# Altium schematic sheet PowerModule.SchDoc: CAN Current Loop Module - Power
size A4; Author: Pablo R Nava; DrawnBy: Pablo R Nava; Engineer: Pablo R Nava
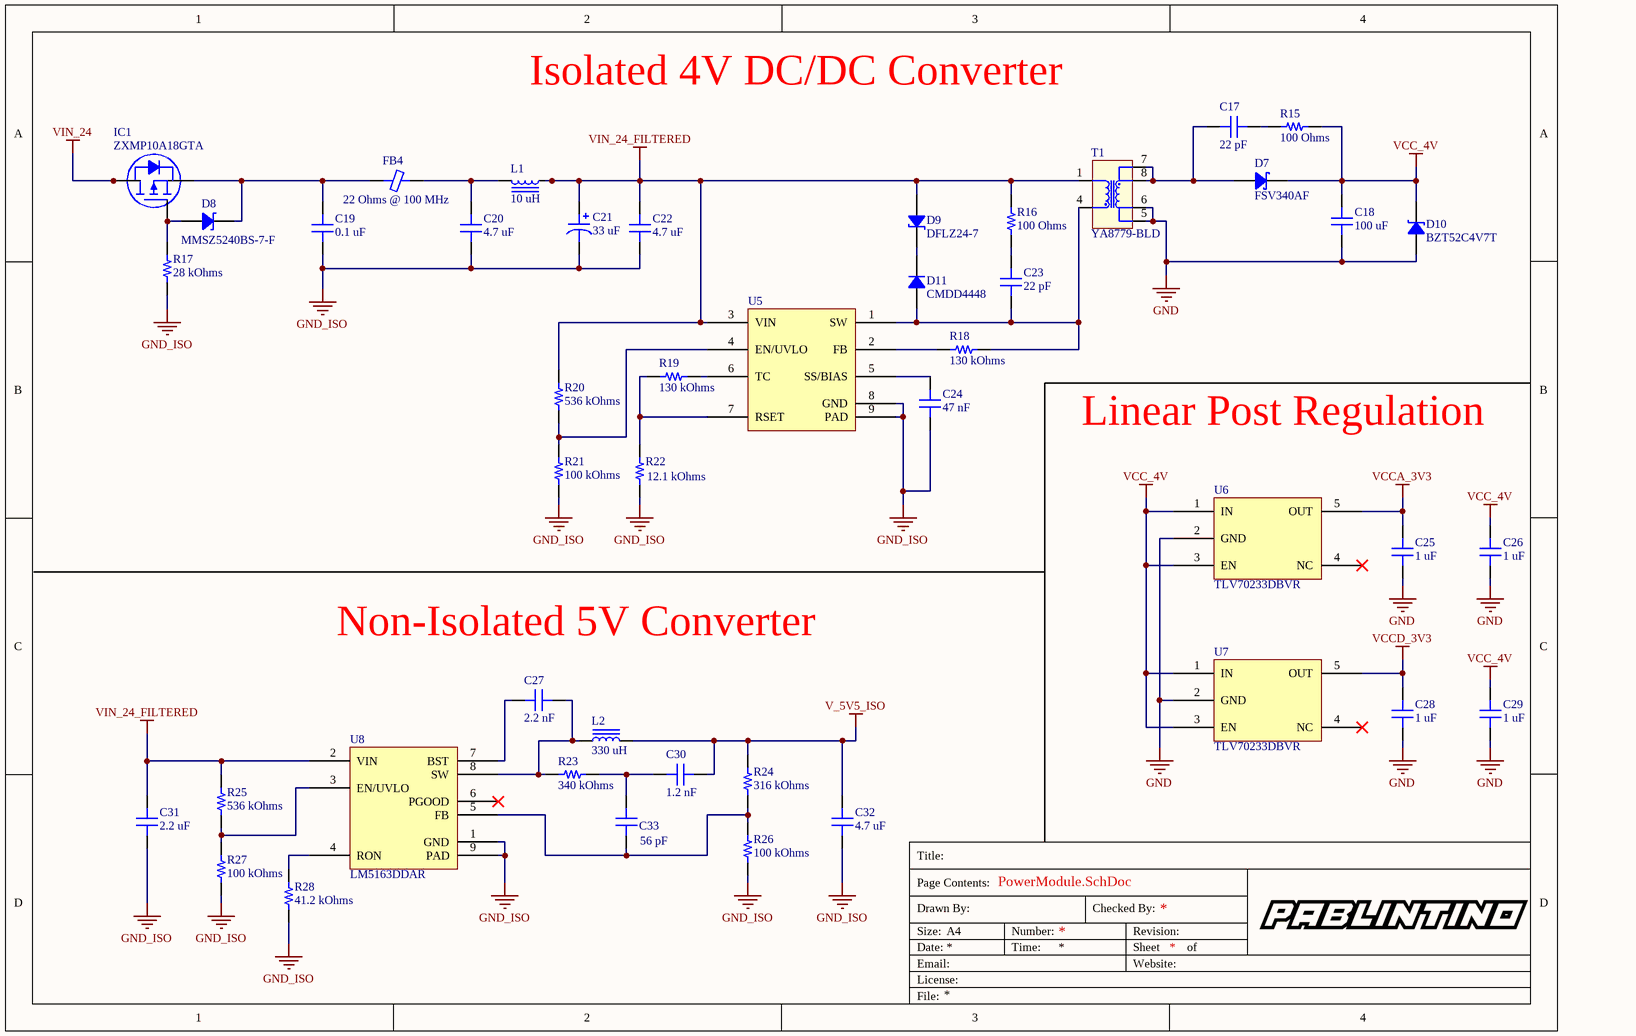
[diagram p0: PowerModule.SchDoc]

## Parts
C17  22 pF  [CAP 0805_2012]
C18  100 uF  [CAP 1210_3225 - 2.5MM]
C19  0.1 uF  [CAP 0805_2012]
C20  4.7 uF  [CAP 1210_3225 - 2.0MM]
C21  33 uF  [CAP ALSMD POLY 10.3MM H10.2MM]
C22  4.7 uF  [CAP 1210_3225 - 2.0MM]
C23  22 pF  [CAP 0805_2012]
C24  47 nF  [CAP 0805_2012]
C25  1 uF  [CAP 0805_2012]
C26  1 uF  [CAP 0805_2012]
C27  2.2 nF  [CAP 0805_2012]
C28  1 uF  [CAP 0805_2012]
C29  1 uF  [CAP 0805_2012]
C30  1.2 nF  [CAP 0805_2012]
C31  2.2 uF  [CAP 1210_3225 - 2.5MM]
C32  4.7 uF  [CAP 1210_3225 - 2.0MM]
C33  56 pF  [CAP 0805_2012]
D7  FSV340AF  [ON DO214AD SMAF]
D8  MMSZ5240BS-7-F  [SOD-123]
D9  DFLZ24-7  [POWERDI123]
D10  BZT52C4V7T  [SOD-523]
D11  CMDD4448  [SOD323]
FB4  22 Ohms @ 100 MHz  [FER 0805_2012]
IC1  ZXMP10A18GTA  [DIODES SOT-223]
L1  10 uH  [WE-TPC_4818]
L2  330 uH  [BOURNS SRR1280]
R15  100 Ohms  [RES 0805_2012]
R16  100 Ohms  [RES 0805_2012]
R17  28 kOhms  [RES 0805_2012]
R18  130 kOhms  [RES 0805_2012]
R19  130 kOhms  [RES 0805_2012]
R20  536 kOhms  [RES 0805_2012]
R21  100 kOhms  [RES 0805_2012]
R22  12.1 kOhms  [RES 0805_2012]
R23  340 kOhms  [RES 0805_2012]
R24  316 kOhms  [RES 0805_2012]
R25  536 kOhms  [RES 0805_2012]
R26  100 kOhms  [RES 0805_2012]
R27  100 kOhms  [RES 0805_2012]
R28  41.2 kOhms  [RES 0805_2012]
T1  YA8779-BLD  [YA8779]
U5  LM5180QNGURQ1  [TI WSON-8 NGU]  (value not drawn)
U6  TLV70233DBVR  [TI SOT-23-5 DBV]
U7  TLV70233DBVR  [TI SOT-23-5 DBV]
U8  LM5163DDAR  [SOIC_DDAR_TEX]

## Nets
GND: C18.2 C25.2 C26.2 C28.2 C29.2 D10.1 T1.5 T1.6 U6.2(GND) U7.2(GND)
GND_ISO: C19.2 C20.1 C21.2 C22.1 C24.1 C31.1 C32.1 R17.1 R21.1 R22.2 R26.2 R27.1 R28.2 U5.8(GND) U5.9(PAD) U8.1(GND) U8.9(PAD)
V_5V5_ISO: C30.1 C32.2 L2.2 R24.1
VCC_4V: C18.1 C26.1 C29.1 D7.2 D10.2 R15.1 U6.1(IN) U6.3(EN) U7.1(IN) U7.3(EN)
VCCA_3V3: C25.1 U6.5(OUT)
VCCD_3V3: C28.1 U7.5(OUT)
VIN_24: IC1.2(D) IC1.4(D)
VIN_24_FILTERED: C21.1 C22.2 C31.2 D9.1 L1.1 R16.2 R20.1 R25.1 T1.1 U5.3(VIN) U8.2(VIN)
NetC17_1: C17.1 D7.1 T1.7 T1.8
NetC17_2: C17.2 R15.2
NetC19_1: C19.1 D8.2 FB4.2 IC1.3(S)
NetC20_2: C20.2 FB4.1 L1.2
NetC23_1: C23.1 R16.1
NetC23_2: C23.2 D11.1 R18.1 T1.4 U5.1(SW)
NetC24_2: C24.2 U5.5(SS/BIAS)
NetC27_1: C27.1 L2.1 R23.2 U8.8(SW)
NetC27_2: C27.2 U8.7(BST)
NetC30_2: C30.2 C33.2 R23.1
NetC33_1: C33.1 R24.2 R26.1 U8.5(FB)
NetD8_1: D8.1 IC1.1(G) R17.2
NetD9_2: D9.2 D11.2
NetR18_2: R18.2 U5.2(FB)
NetR19_1: R19.1 U5.6(TC)
NetR19_2: R19.2 R22.1 U5.7(RSET)
NetR20_2: R20.2 R21.2 U5.4(EN/UVLO)
NetR25_2: R25.2 R27.2 U8.3(EN/UVLO)
NetR28_1: R28.1 U8.4(RON)

Not connected (* = marked no-connect by the designer): U6 4(NC)*; U7 4(NC)*; U8 6(PGOOD)*

## Notes on the sheet
- Isolated 4V DC/DC Converter
- Linear Post Regulation
- Non-Isolated 5V Converter
- Title:
- Drawn By:
- Page Contents:
- Checked By:
- Size:
- Date:
- File:
- License:
- Email:
- A4
- Number:
- Time:
- Revision:
- Sheet
- Website:
- of

## Library data of the parts
C17 C23 = 08051C220JAT2A: MLCC Ceramic 22 pF 100 V 5% Capacitor; Manufacturer: AVX; Voltage: 100 V; Type: capacitor_ceramic; Through Hole: 0; Part Number: 08051C220JAT2A; Value: 22 pF; Tolerance: 5%; Composition: X7R; Created On: 03/07/2020 16:35:00; Updated On: 03/07/2020 16:36:02; Package: 0805 (2012 Metric)
C18 = JMK325AC7107MM-P: MLCC Ceramic 100 uF 6.3 V 20% Capacitor; Manufacturer: Taiyo Yuden; Voltage: 6.3 V; Type: capacitor_ceramic; Through Hole: 0; Part Number: JMK325AC7107MM-P; Value: 100 uF; Tolerance: 20%; Composition: X7S; Created On: 03/07/2020 19:44:15; Updated On: 03/07/2020 19:44:30; Package: 1210 (3225 Metric)
C19 = 08051C104J4T4A: MLCC Ceramic 0.1 uF 100 V 10% Capacitor; Manufacturer: AVX; Voltage: 100 V; Type: capacitor_ceramic; Through Hole: 0; Part Number: 08051C104J4T4A; Value: 0.1 uF; Tolerance: 10%; Composition: X7R; Created On: 10/07/2020 23:21:56; Updated On: 10/07/2020 23:22:31; Package: 0805 (2012 Metric)
C20 C22 C32 = C3225X7S2A475M200AB: MLCC Ceramic 4.7 uF 100 V 20% Capacitor; Manufacturer: TDK; Voltage: 100 V; Type: capacitor_ceramic; Through Hole: 0; Part Number: C3225X7S2A475M200AB; Value: 4.7 uF; Tolerance: 20%; Composition: X7S; Created On: 10/07/2020 20:19:29; Updated On: 10/07/2020 20:19:45; Package: 1210 (3225 Metric)
C21 = EEEFK2A330P: Aluminum Electrolytic 33 uF 100 V 20% Capacitor; Manufacturer: Panasonic; Voltage: 100 V; Material: aluminium; Polarised: 1; ESR: 700 mOhms; Lifetime Temperature: 2000 Hours @ 105 ºC; Minimum Temperature: 105 ºC; Maximum Temperature: -55 ºC; Type: capacitor_electrolytic; Through Hole: 0; Part Number: EEEFK2A330P; Value: 33 uF; Tolerance: 20%; Created On: 08/07/2020 20:44:47; Updated On: 08/07/2020 21:47:25; Package: SMD
C24 = C2012X7R2A473K125AA: MLCC Ceramic 47 nF 100 V 10% Capacitor; Manufacturer: TDK; Voltage: 200 V; Type: capacitor_ceramic; Through Hole: 0; Part Number: C2012X7R2A473K125AA; Value: 47 nF; Tolerance: 10%; Composition: X7R; Created On: 31/05/2020 9:04:57; Updated On: 31/05/2020 9:07:12; Package: 0805 (2012 Metric)
C25 C26 C28 C29 = 0805YC105KAT4A: MLCC Ceramic 1 uF 16 V 10% Capacitor; Manufacturer: AVX; Voltage: 16 V; Type: capacitor_ceramic; Through Hole: 0; Part Number: 0805YC105KAT4A; Value: 1 uF; Tolerance: 10%; Composition: X7R; Created On: 18/07/2020 20:46:26; Updated On: 18/07/2020 20:46:47; Package: 0805 (2012 Metric)
C27 = C0805C222K5RACTU: MLCC Ceramic 2.2 nF 50 V 10% Capacitor; Manufacturer: KEMET; Voltage: 50 V; Type: capacitor_ceramic; Through Hole: 0; Part Number: C0805C222K5RACTU; Value: 2.2 nF; Tolerance: 10%; Composition: X7R; Created On: 16/07/2020 19:02:56; Updated On: 16/07/2020 19:04:14; Package: 0805 (2012 Metric)
C30 = 08055C122KAT2A: MLCC Ceramic 1.2 nF 50 V 10% Capacitor; Manufacturer: AVX; Voltage: 50 V; Type: capacitor_ceramic; Through Hole: 0; Part Number: 08055C122KAT2A; Value: 1.2 nF; Tolerance: 10%; Composition: X7R; Created On: 16/07/2020 19:09:00; Updated On: 16/07/2020 19:09:07; Package: 0805 (2012 Metric)
C31 = C3225X7R2A225K230AB: MLCC Ceramic 2.2 uF 100 V 10% Capacitor; Manufacturer: TDK; Voltage: 100 V; Type: capacitor_ceramic; Through Hole: 0; Part Number: C3225X7R2A225K230AB; Value: 2.2 uF; Tolerance: 10%; Composition: X7R; Created On: 20/07/2020 23:03:57; Updated On: 20/07/2020 23:04:45; Package: 1210 (3225 Metric)
C33 = 08055A560JAT2A: MLCC Ceramic 56 pF 50 V 5% Capacitor; Manufacturer: AVX; Tolerance: 10%; Voltage: 50 V; Type: capacitor_ceramic; Through Hole: 0; Part Number: 08055A560JAT2A; Value: 56 pF; Composition: NP0; Created On: 16/07/2020 19:36:43; Updated On: 16/07/2020 19:36:54; Package: 0805 (2012 Metric)
D7 = FSV340AF: Schottky Diode; Manufacturer: ON Semiconductor; Forward Voltage: 0.5 V; Reverse Leakage Current: 100 uA; Maximum Forward Avg. Current: 3 A; Maximum Repetitive Reverse Voltage: 40 V; Type: diode_rectifier; Through Hole: 0; Part Number: FSV340AF; Diode Type: schottky; Created On: 30/06/2020 19:58:51; Updated On: 30/06/2020 20:11:25; Package: DO-214AD
D8 = MMSZ5240BS-7-F: Zener 200 mW 10 V; Manufacturer: Diodes Incorporated; Maximum Power: 200 mW; Forward Voltage: 0.9 V; Zener Voltage: 10 V; Type: diode_zener; Through Hole: 0; Part Number: MMSZ5240BS-7-F; Created On: 19/07/2020 12:49:44; Updated On: 19/07/2020 13:00:21; Package: SOD-323-2
D9 = DFLZ24-7: Power Zener 1 W 24 V; Manufacturer: Diodes Incorporated; Maximum Power: 1 W; Forward Voltage: 24 V; Type: diode_zener; Through Hole: 0; Part Number: DFLZ24-7; Created On: 30/06/2020 21:18:03; Updated On: 30/06/2020 21:18:48; Package: PowerDI 123-2
D10 = BZT52C4V7T: Zener 300 mW 4.7 V; Part Number: BZT52C4V7T
D11 = CMDD4448: High Speed Silicon Switching Diode; Manufacturer: Central Semiconductor Corp.; Forward Voltage: 1 V; Reverse Leakage Current: 25 nA; Maximum Forward Avg. Current: 250 mA; Maximum Repetitive Reverse Voltage: 100 V; Diode Type: rectifier; Type: diode_rectifier; Through Hole: 0; Part Number: CMDD4448; Created On: 02/07/2020 19:02:22; Updated On: 02/07/2020 19:05:20; Package: SOD-323
FB4 = 742792021: Ferrite bead 22 Ohms @ 100 MHz; Manufacturer: Würth Electronik; Number of Lines: 1; DC Resistance: 8 mOhms; Current Rating: 6 A; Type: ferrite_bead; Through Hole: 0; Part Number: 742792021; Value: 22 Ohms @ 100 MHz; Impedance Frequency: 22 Ohms @ 100 MHz; Created On: 10/07/2020 22:54:16; Updated On: 10/07/2020 23:17:54; Package: 0805 (2012 Metric)
IC1 = ZXMP10A18GTA: MOSFET 100V P-Chnl UMOS; Manufacturer: Diodes Incorporated; Drain Source Resistance: 150 mOhms; Gate Source Max Voltage: 20 V; Gate Source Threshold Voltage: 2 V; Drain Source Max Current: 3.7 A; Maximum Power: 3.9 W; Channel Type: P-Channel; Through Hole: 0; Part Number: ZXMP10A18GTA; Drain Source Max Voltage: 100 V; Created On: 19/07/2020 8:37:51; Updated On: 19/07/2020 11:20:23; Type: transistor_mosfet; Package: SOT-223-4
L1 = 744042100: Tinny Power Inductor 10 uH 1.3 A; Manufacturer: Würth Electronik; Resistance DCR: 120 mOhms; Test Frequency: 100 kHz; Current Rating: 1.3 A; Current Saturation: 1 A; Tolerance: 30%; Type: power_inductor; Through Hole: 0; Part Number: 744042100; Value: 10 uH; Created On: 10/07/2020 20:04:38; Updated On: 10/07/2020 20:09:18; Package: ACT45B
L2 = SRR1208-331KL: Shielded Power Inductor 330 uH 0.85 A; Manufacturer: Bourns; Resistance DCR: 650 mOhms; Test Frequency: 0.796 MHz; Current Rating: 0.85 A; Current Saturation: 1.12 A; Tolerance: 10%; Type: power_inductor; Through Hole: 0; Part Number: SRR1208-331KL; Value: 330 uH; Created On: 13/07/2020 19:41:55; Updated On: 13/07/2020 19:43:17; Package: SRR1280
R15 R16 = CRCW0805100RFKEAC: Thin Film Resistor 100 Ohms 1%; Manufacturer: Vishay / Dale; Power Max: 125 mW; Through Hole: 0; Part Number: CRCW0805100RFKEAC; Value: 100 Ohms; Tolerance: 1%; Created On: 16/05/2020 11:51:25; Updated On: 16/05/2020 13:13:19; Type: resistor; Package: 0805 (2012 Metric)
R17 = CRCW080528K0FKEA: Thin Film Resistor 28 kOhms 1%; Manufacturer: Vishay / Dale; Power Max: 125 mW; Through Hole: 0; Part Number: CRCW080528K0FKEA; Value: 28 kOhms; Tolerance: 1%; Created On: 19/07/2020 13:06:42; Updated On: 19/07/2020 13:07:02; Type: resistor; Package: 0805 (2012 Metric)
R18 R19 = CRCW0805130KFKEAC: Thin Film Resistor 130 kOhms 1%; Manufacturer: Vishay / Dale; Power Max: 125 mW; Through Hole: 0; Part Number: CRCW0805130KFKEAC; Value: 130 kOhms; Tolerance: 1%; Created On: 09/07/2020 18:08:17; Updated On: 09/07/2020 18:08:28; Type: resistor; Package: 0805 (2012 Metric)
R20 R25 = CRCW0805536KFKEA: Thin Film Resistor 536 kOhms 1%; Manufacturer: Vishay / Dale; Power Max: 125 mW; Through Hole: 0; Part Number: CRCW0805536KFKEA; Value: 536 kOhms; Tolerance: 1%; Created On: 09/07/2020 18:04:35; Updated On: 09/07/2020 18:04:45; Type: resistor; Package: 0805 (2012 Metric)
R21 R26 R27 = CRCW0805100KFKEAC: Thin Film Resistor 100 kOhms 1%; Manufacturer: Vishay / Dale; Power Max: 125 mW; Through Hole: 0; Part Number: CRCW0805100KFKEAC; Value: 100 kOhms; Tolerance: 1%; Created On: 09/07/2020 18:07:58; Updated On: 09/07/2020 18:08:25; Type: resistor; Package: 0805 (2012 Metric)
R22 = CRCW080512K1FKEA: Thin Film Resistor 12.1 kOhms 1%; Manufacturer: Vishay / Dale; Power Max: 125 mW; Through Hole: 0; Part Number: CRCW080512K1FKEA; Value: 12.1 kOhms; Tolerance: 1%; Created On: 09/07/2020 18:06:27; Updated On: 09/07/2020 18:06:42; Type: resistor; Package: 0805 (2012 Metric)
R23 = CRCW0805340KFKEAC: Thin Film Resistor 340 kOhms 1%; Manufacturer: Vishay / Dale; Power Max: 125 mW; Through Hole: 0; Part Number: CRCW0805340KFKEAC; Value: 340 kOhms; Tolerance: 1%; Created On: 16/07/2020 18:43:47; Updated On: 16/07/2020 18:45:23; Type: resistor; Package: 0805 (2012 Metric)
R24 = CRCW0805316KFKEAC: Thin Film Resistor 316 kOhms 1%; Manufacturer: Vishay / Dale; Power Max: 125 mW; Through Hole: 0; Part Number: CRCW0805316KFKEAC; Value: 316 kOhms; Tolerance: 1%; Created On: 16/07/2020 18:47:45; Updated On: 16/07/2020 18:48:00; Type: resistor; Package: 0805 (2012 Metric)
R28 = CRCW080541K2FKEAC: Thin Film Resistor 41.2 kOhms 1%; Manufacturer: Vishay / Dale; Power Max: 125 mW; Through Hole: 0; Part Number: CRCW080541K2FKEAC; Value: 41.2 kOhms; Tolerance: 1%; Created On: 16/07/2020 18:51:09; Updated On: 16/07/2020 18:51:15; Type: resistor; Package: 0805 (2012 Metric)
T1 = YA8779-BLD: YA8779 Flyback Transformer; Manufacturer: Coilcraft; Number of Windings: 2; Primary DCR: 0.140 Ohms; Secondary DCR: 0.013 Ohms; Current Rating: 0.380 uH; Primary Inductance: 30 uH; Secondary Current Rating: 1.2 A; Primary Voltage Rating: 70 V; Secondary Voltage Rating: 5 V; NPS Turns Ratio: 1:0.330; Through Hole: 0; Part Number: YA8779-BLD; Created On: 24/06/2020 22:00:46; Updated On: 29/06/2020 22:52:20; Type: transformer; Package: YA8779
U5 = LM5180QNGURQ1: 65-V IN PSR Flyback DC/DC Converter with 100-V, 1.5-A Integrated Power MOSFET; Part Number: LM5180QNGURQ1
U6 U7 = TLV70233DBVR: TLV702 300-mA, Low-IQ, Low-Dropout Regulator; Part Number: TLV70233DBVR
U8 = LM5163DDAR: 100-V Input, 0.5-A Synchronous Buck DC/DC Converter with Ultra-low IQ; Manufacturer: Texas Instruments; Minimum Input Voltage: 6 V; Maximum Output Voltage: 100 V; Output Current: 0.5 A; Switching Frequency: 1 MHz; Output Type: TBD; Number of Outputs: 1; Through Hole: 0; Part Number: LM5163DDAR; Topology: buck; Created On: 13/07/2020 20:55:36; Updated On: 13/07/2020 20:57:00; Type: voltage_regulator_dcdc; Package: PowerPAD-8